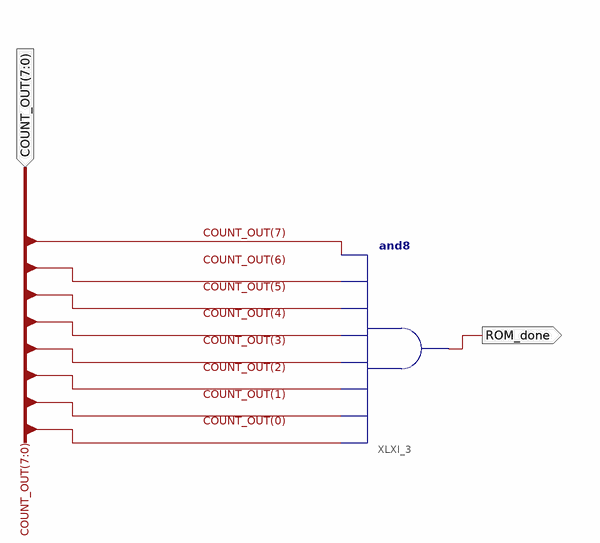
[diagram p0: schematic sheet 1]
// Xilinx ISE schematic AND_bootstrap.sch (spartan3e) as structural Verilog: 1 symbols, 2 ports
module AND_bootstrap (
  input  [7:0] COUNT_OUT,
  output ROM_done
);

  and XLXI_3 (ROM_done, COUNT_OUT[0], COUNT_OUT[1], COUNT_OUT[2], COUNT_OUT[3], COUNT_OUT[4], COUNT_OUT[5], COUNT_OUT[6], COUNT_OUT[7]);
endmodule
